# Altium schematic sheet [01]-COVER PAGE.SchDoc
size A4; Revision: 1.0; SheetNumber: 1; SheetTotal: 2
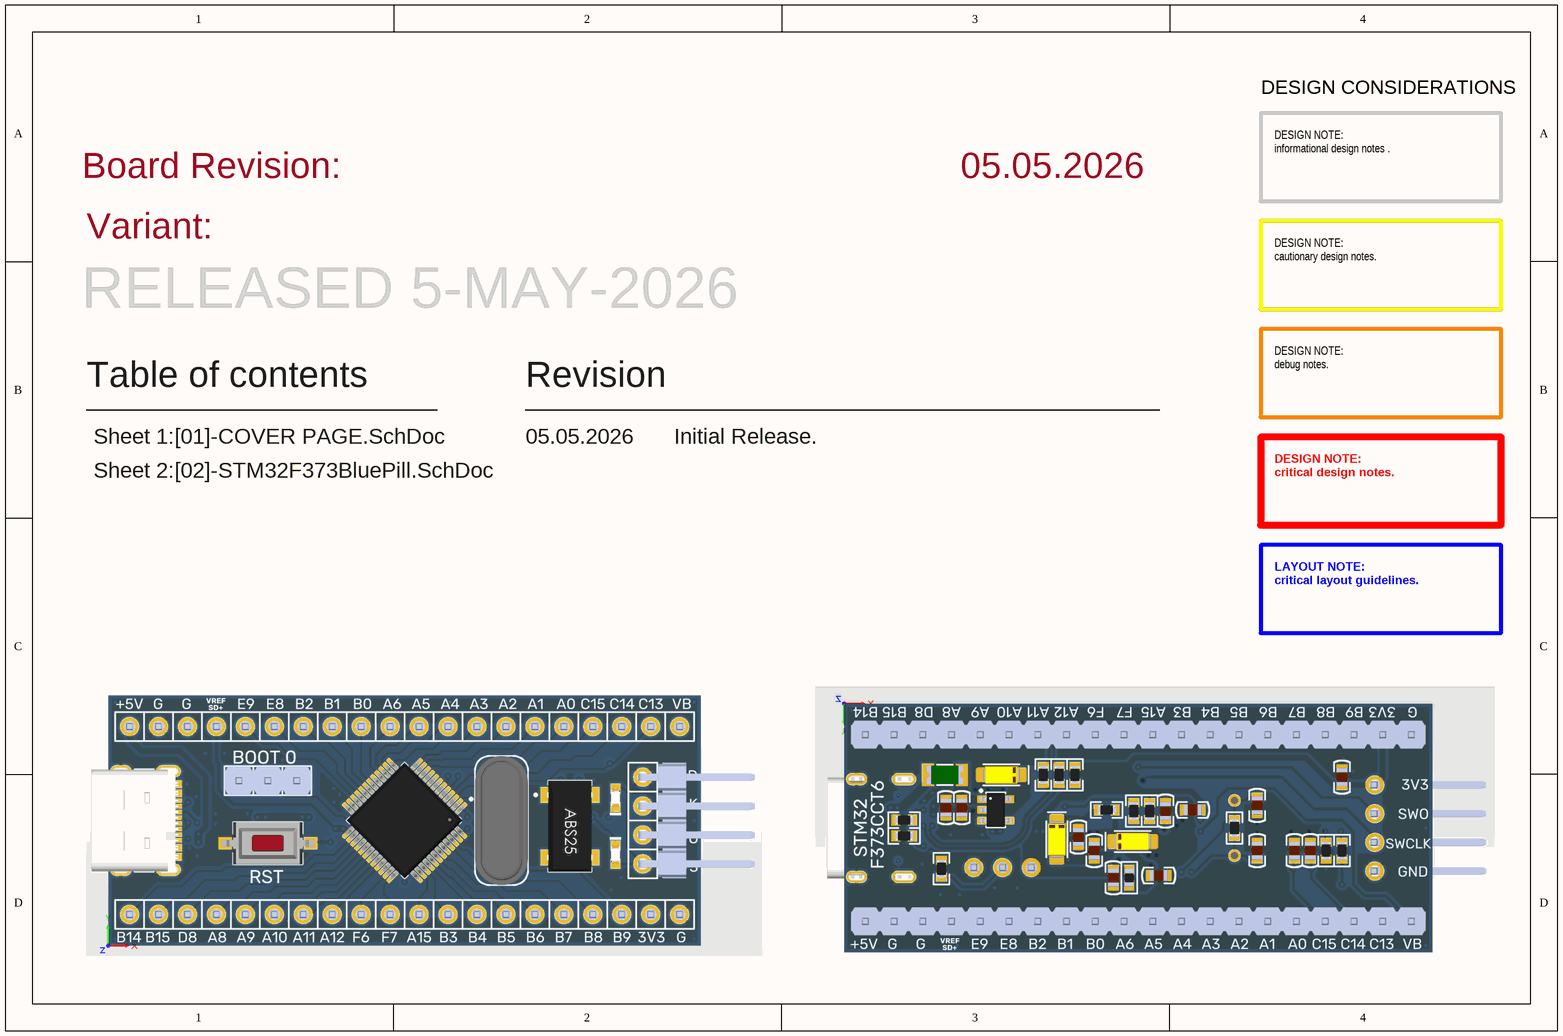
[diagram p0: [01]-COVER PAGE.SchDoc]

## Notes on the sheet
- DESIGN CONSIDERATIONS
- Variant:
- Board Revision:
- 05.05.2026
- DESIGN NOTE:
  informational design notes .
- DESIGN NOTE:
  cautionary design notes.
- RELEASED 5-MAY-2026
- Table of contents
- Sheet 1:
- Revision
- Initial Release.
- DESIGN NOTE:
  debug notes.
- Sheet 2:
- [02]-STM32F373BluePill.SchDoc
- DESIGN NOTE:
  critical design notes.
- LAYOUT NOTE:
  critical layout guidelines.